# Altium project SAST_PCB_V2_Test_Beta.PrjPcb (part 2 of 2)
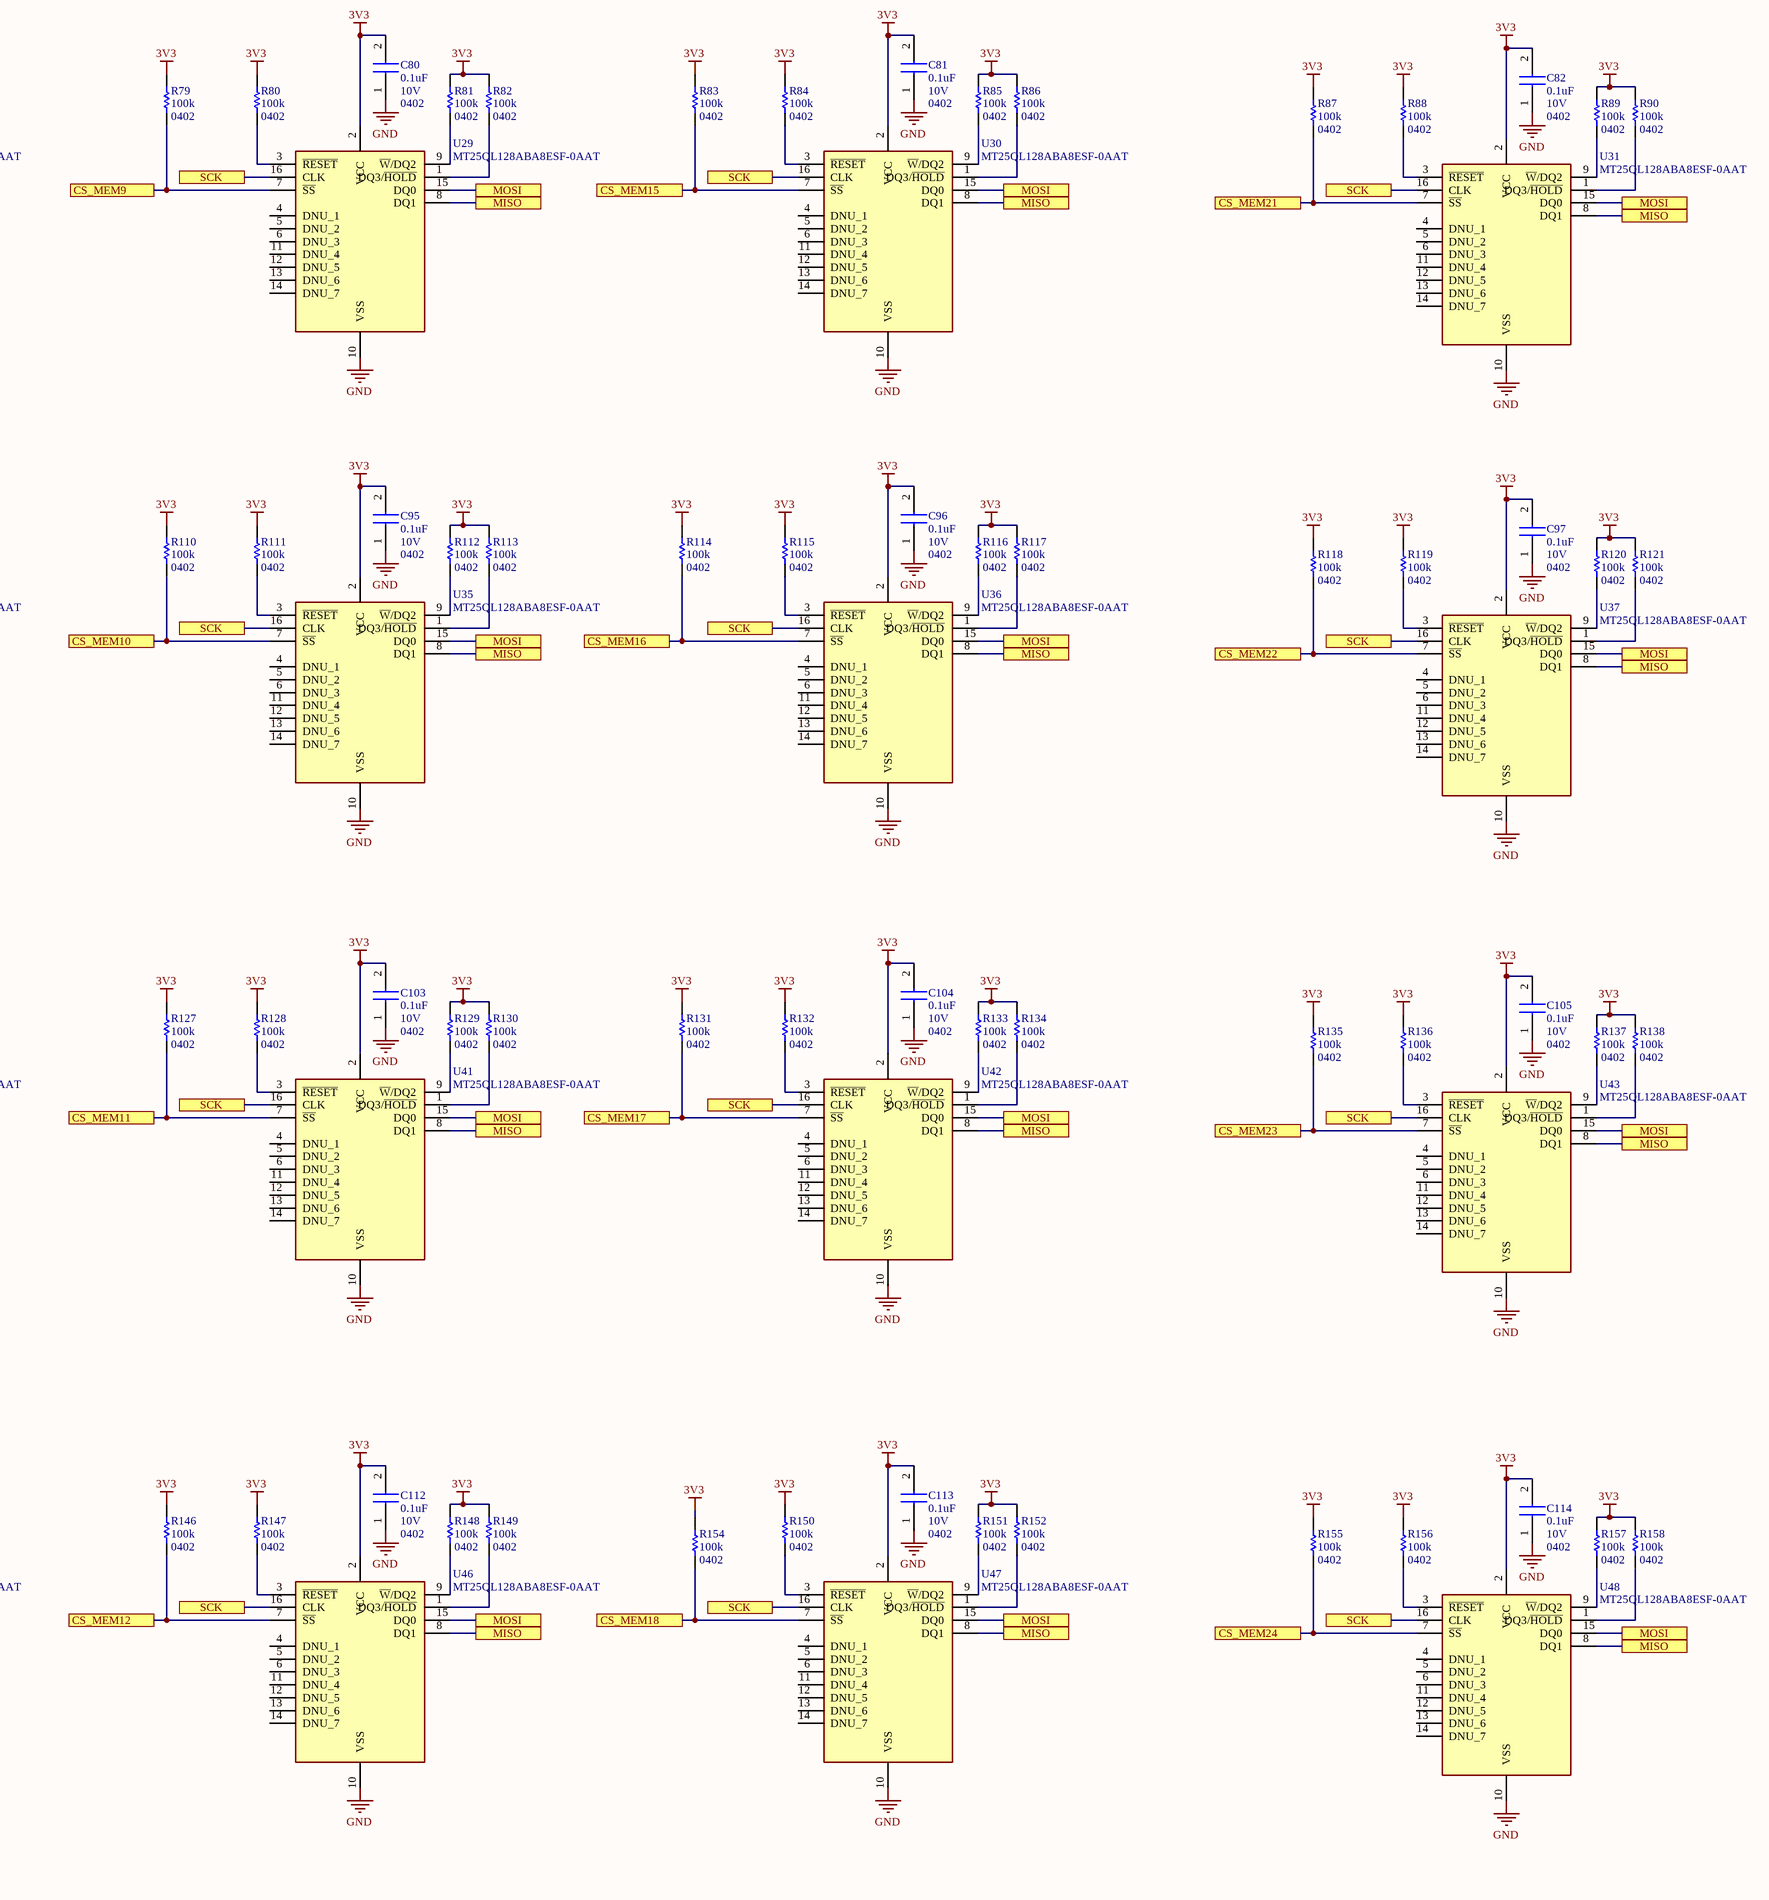
[diagram p6: SAST_PCB_V2B_Test_Beta_Main.SchDoc, bottom right]

## Sheet SAST_PCB_V2B_Test_Beta_Main.SchDoc (continued)

### Nets
3V3: C3.2 C14.1 C27.2 C28.2 C29.2 C30.1 C31.2 C32.1 C54.2 C55.1 C56.2 C57.2 C58.2 C60.2 C61.2 C68.2 C70.2 C71.2 C73.2 C75.2 C79.2 C80.2 C81.2 C82.2 C84.2 C85.2 C86.2 C87.2 C88.2 C89.2 C94.2 C95.2 C96.2 C97.2 C99.2 C100.2 C101.2 C102.2 C103.2 C104.2 C105.2 C106.2 C107.2 C108.2 C109.2 C110.2 C111.2 C112.2 C113.2 C114.2 C115.2 J3.2 J4.1 J19.1 J56.1 L2.2 Q10.4(S2) Q11.4(S2) R13.1 R19.2 R20.2 R22.2 R23.2 R24.2 R25.2 R26.2 R27.2 R28.2 R29.2 R30.2 R31.2 R32.2 R33.2 R34.2 R35.2 R36.2 R37.2 R40.1 R46.1 R47.2 R48.2 R49.2 R50.2 R55.2 R56.2 R57.2 R58.2 R59.2 R60.2 R61.2 R62.2 R63.2 R64.2 R65.2 R66.2 R75.2 R76.2 R77.2 R78.2 R79.2 R80.2 R81.2 R82.2 R83.2 R84.2 R85.2 R86.2 R87.2 R88.2 R89.2 R90.2 R100.2 R106.2 R107.2 R108.2 R109.2 R110.2 R111.2 R112.2 R113.2 R114.2 R115.2 R116.2 R117.2 R118.2 R119.2 R120.2 R121.2 R122.2 R123.2 R124.2 R125.2 R126.2 R127.2 R128.2 R129.2 R130.2 R131.2 R132.2 R133.2 R134.2 R135.2 R136.2 R137.2 R138.2 R139.2 R143.2 R144.2 R145.2 R146.2 R147.2 R148.2 R149.2 R150.2 R151.2 R152.2 R153.2 R154.2 R155.2 R156.2 R157.2 R158.2 R161.2 R174.1 R182.1 R188.1 TP19.1 U2.3(VCCA) U4.5(VIO) U13.1(VS) U13.2(VIO) U14.2(VIO) U14.3(VDD) U15.2(VCC) U16.8(VDD) U17.2(VCC) U18.2(VCC) U19.2(VCC) U21.2(VCC) U22.2(VCC) U23.2(VCC) U25.2(VCC) U26.8(VDD) U28.2(VCC) U29.2(VCC) U30.2(VCC) U31.2(VCC) U32.2(VIN) U33.5(VDD) U33.6(VDD) U33.19(VDRIVE) U34.2(VCC) U35.2(VCC) U36.2(VCC) U37.2(VCC) U38.13(VDD_1) U38.14(VDD_2) U39.7(~{HOLD}/SIO3) U39.8(VCC) U40.2(VCC) U41.2(VCC) U42.2(VCC) U43.2(VCC) U44.13(AVDD) U44.18(VDD_1) U44.32(VDD_2) U44.43(VDD_3) U45.2(VCC) U46.2(VCC) U47.2(VCC) U48.2(VCC) U50.8(VDD) Y1.4(VDD) ; port 3V3
5V: C4.2 C25.2 C26.2 L1.1 Q7.4(S2) R1.2 R6.2 R8.1 R12.1 R21.2 R42.2 R91.2 R172.1 TP18.1 U2.7(VCCB(HV))
GND: C1.1 C2.2 C3.1 C4.1 C5.1 C6.2 C7.1 C8.2 C9.2 C10.2 C11.1 C12.1 C13.1 C14.2 C15.2 C16.1 C17.2 C18.1 C19.2 C20.2 C21.2 C22.2 C23.1 C24.2 C25.1 C28.1 C29.1 C30.2 C33.1 C34.1 C35.2 C36.1 C37.1 C38.1 C39.2 C40.2 C41.1 C42.1 C43.2 C44.1 C45.2 C46.1 C47.2 C48.1 C49.2 C50.1 C52.1 C53.2 C54.1 C55.2 C56.1 C57.1 C58.1 C60.1 C61.1 C62.1 C65.1 C67.1 C68.1 C69.2 C70.1 C71.1 C73.1 C75.1 C77.1 C79.1 C80.1 C81.1 C82.1 C83.1 C84.1 C85.1 C86.1 C87.1 C88.1 C89.1 C93.1 C94.1 C95.1 C96.1 C97.1 C99.1 C100.1 C101.1 C102.1 C103.1 C104.1 C105.1 C106.1 C107.1 C108.1 C109.1 C110.1 C111.1 C112.1 C113.1 C114.1 C115.1 C116.1 C117.1 D2.3(CC) J1.11 J1.12 J1.13 J1.14 J1.15 J3.3 J52.1 J53.1 J57.1 Q2.2(E) Q4.2(E) Q7.1(R2) Q8.2(E) Q9.2(E) Q10.1(R2) Q11.1(R2) R9.2 R11.2 R14.1 R15.1 R18.2 R41.1 R45.1 R70.1 R74.1 R95.1 R97.2 R98.1 R99.1 R102.2 R142.2 R164.1 R183.1 U1.3(GND) U2.2(GND) U3.3(GND) U4.2(VSS) U5.2(GND) U5.3(CTL) U6.4(MODE/SYNC) U6.5(PHASE) U6.7(ILIM) U6.17(GND) U7.3(GND) U8.2(GND) U8.3(CTL) U9.4(GND) U10.5(-VS) U11.2(GND) U11.3(CTL) U12.2(GND) U12.3(CTL) U13.10(GND) U14.4(GND) U15.10(VSS) U16.4(VSS) U17.10(VSS) U18.10(VSS) U19.10(VSS) U20.2(VSS) U21.10(VSS) U22.10(VSS) U23.10(VSS) U24.3(GND) U25.10(VSS) U26.4(VSS) U27.3(GND) U28.10(VSS) U29.10(VSS) U30.10(VSS) U31.10(VSS) U32.4(GND) U33.4(AGND_1) U33.8(AGND_2) U33.17(AGND_3) U33.20(AGND_4) U34.10(VSS) U35.10(VSS) U36.10(VSS) U37.10(VSS) U38.21(~{WR}) U38.23(GND) U38.24(VSS) U38.43(D) U38.49(EP) U39.4(VSS) U40.10(VSS) U41.10(VSS) U42.10(VSS) U43.10(VSS) U44.14(AVSS) U44.19(VSS_1) U44.31(VSS_2) U44.42(VSS_3) U45.10(VSS) U46.10(VSS) U47.10(VSS) U48.10(VSS) U50.4(VSS) Y1.2(GND) ; port GND
3V3_MAG_1: C46.2 C47.1 C49.1 C141.1 Q11.2(D2_1) Q11.3(D2_2) R96.1 R183.2 U9.8(VDD) U10.8(+VS) U20.5(VDD) ; port 3V3_MAG_1
3V3_SWH: C129.1 Q10.2(D2_1) Q10.3(D2_2) R99.2 TP9.1 U2.6(OE) ; port 3V3_SWH
3V3_SWL: Q9.3(C) R100.1 TP10.1 U38.22(~{EN}) ; port 3V3_SWL
5V_IN: F5.2 J1.7 ; port 5V_IN
5V_IN_FUSED: C52.2 C53.1 F5.1 Q6.3(DRAIN) R39.2 U12.1(VIN) ; port 5V_IN_FUSED
5V_SW: C9.1 C10.1 C128.1 J5.1 J58.1 Q7.2(D2_1) Q7.3(D2_2) R4.2 R5.1 R98.2 TP8.1 U1.1(~{OE}) U4.3(VDD) ; port 5V_SW
ADC_REF_2500: C50.2 TP1.1 U32.6(VOUT) U33.7(REFIN) ; port ADC_REF_2500
BAT1: F2.2 J1.1 J1.2 ; port BAT1
BAT2: F3.2 J1.3 J1.4 ; port BAT2
BAT3: F4.2 J1.5 J1.6 ; port BAT3
CAN_Enable: R7.2 U44.6(ANN4/CMP5B/RP77/RD13) ; port CAN_Enable
CAN_IN_FUSED: C5.2 C7.2 C8.1 C11.2 D1.3(A2) D1.4(A1) R2.1 R44.2 ; port CAN_IN_FUSED
CAN_PWR: F1.2 J6.1 ; port CAN_PWR
CAN_RXD: U4.1(TXD) U44.2(RP47/PWM1L/RB15) ; port CAN_RXD
CAN_TXD: U4.4(RXD) U44.1(RP46/PWM1H/RB14) ; port CAN_TXD
CANH: C6.1 D2.1(K1) J8.1 R3.2 U4.7(CANH) ; port CANH
CANL: C15.1 D2.2(K2) J7.1 R3.1 U4.6(CANL) ; port CANL
COM_OVERRIDE: Q4.3(C) R8.2 TP2.1 U24.1(IN) U27.1(~{OE}) ; port COM_OVERRIDE
COM_SW: R10.2 U44.7(AN12/ANN0/RP48/RC0) ; port COM_SW
CS_4K_Gyro: J25.1 U44.48(RP45/PWM2L/RB13) ; port CS_4K_Gyro
CS_CONT: U38.20(~{CS}) U44.40(RP58/PWM7H/RC10) ; port CS_CONT
CS_GYRO: J12.1 U44.38(RP52/PWM5H/ASDA2/RC4) ; port CS_GYRO
CS_HG1: R19.1 U13.6(CS) U44.39(RP53/PWM5L/ASCL2/RC5) ; port CS_HG1
CS_LG1: J18.1 U44.24(DACOUT2/AN16/CMP4C/ISRC2/_RP55/RC7) ; port CS_LG1
CS_LG2: J17.1 U44.17(AN17/ANN1/CMP4B/IBIAS1/_RP54/RC6) ; port CS_LG2
CS_MAG: R40.2 U14.1(CS) U44.16(OA3IN+/AN14/CMP2B/ISRC1/_RP50/RC2) ; port CS_MAG
CS_MEM1: R26.1 U17.7(~{SS}) U38.11(S2) ; port CS_MEM1
CS_MEM2: R55.1 U22.7(~{SS}) U38.10(S3) ; port CS_MEM2
CS_MEM3: R75.1 U28.7(~{SS}) U38.9(S4) ; port CS_MEM3
CS_MEM4: R106.1 U34.7(~{SS}) U38.8(S5) ; port CS_MEM4
CS_MEM5: R123.1 U38.7(S6) U40.7(~{SS}) ; port CS_MEM5
CS_MEM6: R153.1 U38.6(S7) U45.7(~{SS}) ; port CS_MEM6
CS_MEM7: R22.1 U15.7(~{SS}) U38.5(S8) ; port CS_MEM7
CS_MEM8: R47.1 U21.7(~{SS}) U38.4(S9) ; port CS_MEM8
CS_MEM9: R79.1 U29.7(~{SS}) U38.3(S10) ; port CS_MEM9
CS_MEM10: R110.1 U35.7(~{SS}) U38.2(S11) ; port CS_MEM10
CS_MEM11: R127.1 U38.1(S12) U41.7(~{SS}) ; port CS_MEM11
CS_MEM12: R146.1 U38.48(S13) U46.7(~{SS}) ; port CS_MEM12
CS_MEM13: R30.1 U18.7(~{SS}) U38.47(S14) ; port CS_MEM13
CS_MEM14: R59.1 U23.7(~{SS}) U38.46(S15) ; port CS_MEM14
CS_MEM15: R83.1 U30.7(~{SS}) U38.45(S16) ; port CS_MEM15
CS_MEM16: R114.1 U36.7(~{SS}) U38.25(S17) ; port CS_MEM16
CS_MEM17: R131.1 U38.26(S18) U42.7(~{SS}) ; port CS_MEM17
CS_MEM18: R154.1 U38.27(S19) U47.7(~{SS}) ; port CS_MEM18
CS_MEM19: R34.1 U19.7(~{SS}) U38.28(S20) ; port CS_MEM19
CS_MEM20: R63.1 U25.7(~{SS}) U38.29(S21) ; port CS_MEM20
CS_MEM21: R87.1 U31.7(~{SS}) U38.30(S22) ; port CS_MEM21
CS_MEM22: R118.1 U37.7(~{SS}) U38.31(S23) ; port CS_MEM22
CS_MEM23: R135.1 U38.32(S24) U43.7(~{SS}) ; port CS_MEM23
CS_MEM24: R155.1 U38.33(S25) U48.7(~{SS}) ; port CS_MEM24
CS_SRAM1: R122.1 U39.1(~{CS}) U44.15(OA3IN-/AN13/CMP1B/ISRC0/_RP49/RC1) ; port CS_SRAM1
CS_VOLT: R54.1 U44.20(AN15/ANN2/CMP2A/IBIAS2/_RP51/RC3) ; port CS_VOLT
CTL_CS_A0: U38.15(A0) U44.12(OA3OUT/AN4/ANB1/ANB2/CMP3B/_IBIAS3/RA4) ; port CTL_CS_A0
CTL_CS_A1: U38.16(A1) U44.11(DACOUT1/AN27/AN3/CMP1C/RA3) ; port CTL_CS_A1
CTL_CS_A2: U38.17(A2) U44.10(OA1IN+/AN9/RA2) ; port CTL_CS_A2
CTL_CS_A3: U38.18(A3) U44.9(OA1IN-/ANA1/RA1) ; port CTL_CS_A3
CTL_CS_A4: U38.19(A4) U44.8(OA1OUT/AN0/CMP1A/IBIAS0/RA0) ; port CTL_CS_A4
Gyro_CONV: J13.1 U44.33(PGD3/RP37/PWM6L/SDA2/RB5) ; port Gyro_CONV
Gyro_Ref_2048: J2.1 R105.2 ; port Gyro_Ref_2048
Gyro_Ref_4096: J11.1 R94.2 ; port Gyro_Ref_4096
Int_4K_Gyro: J27.1 U44.44(RP65/PWM4H/RD1) ; port Int_4K_Gyro
INT_Alert_2: R20.1 U13.5(INT1) U44.25(OA2OUT/AN1/ANA0/CMP1D/RP34/SCL3/INT0/RB2) ; port INT_Alert_2
MAG_ANAL_1: C48.2 R73.1 TP5.1 U33.10(VIN6) ; port MAG_ANAL_1
MAG_ANAL_2: J21.1 U33.9(VIN7) ; port MAG_ANAL_2
MCLR: J3.1 R163.2 U44.5(!MCLR) ; port MCLR
MISO: U15.8(DQ1) U17.8(DQ1) U18.8(DQ1) U19.8(DQ1) U21.8(DQ1) U22.8(DQ1) U23.8(DQ1) U25.8(DQ1) U28.8(DQ1) U29.8(DQ1) U30.8(DQ1) U31.8(DQ1) U34.8(DQ1) U35.8(DQ1) U36.8(DQ1) U37.8(DQ1) U40.8(DQ1) U41.8(DQ1) U42.8(DQ1) U43.8(DQ1) U44.29(RP57/ASCL1/SDI2/RC9) U45.8(DQ1) U46.8(DQ1) U47.8(DQ1) U48.8(DQ1) ; port MISO
MISO1: J14.1 R51.1 U13.7(MISO) U14.8(SDO) U39.2(SO/SIO1) U44.4(RP61/PWM8L/RC13) ; port MISO1
MISO2: J22.1 U44.45(TMS/RP42/PWM3H/RB10) ; port MISO2
MOSI: U15.15(DQ0) U17.15(DQ0) U18.15(DQ0) U19.15(DQ0) U21.15(DQ0) U22.15(DQ0) U23.15(DQ0) U25.15(DQ0) U28.15(DQ0) U29.15(DQ0) U30.15(DQ0) U31.15(DQ0) U34.15(DQ0) U35.15(DQ0) U36.15(DQ0) U37.15(DQ0) U40.15(DQ0) U41.15(DQ0) U42.15(DQ0) U43.15(DQ0) U44.30(RP72/SDO2/PCI19/RD8) U45.15(DQ0) U46.15(DQ0) U47.15(DQ0) U48.15(DQ0) ; port MOSI
MOSI1: J16.1 R52.1 U13.8(MOSI) U14.7(SDA) U39.5(SI/SIO0) U44.3(RP60/PWM8H/RC12) ; port MOSI1
MOSI2: J23.1 U44.46(TCK/RP43/PWM3L/RB11) ; port MOSI2
OSC: R140.1 U44.21(OSCI/CLKI/AN5/RP32/RB0) ; port OSC
PGEC1: J3.5 U44.37(PGC1/AN11/CMP5A/RP41/SDA1/RB9) ; port PGEC1
PGED1: J3.4 U44.36(PGD1/AN10/CMP6A/RP40/SCL1/RB8) ; port PGED1
POWER_SW: D7.2(A) J26.1 R101.2 R175.2 R184.2 U44.23(AN18/ANC2/CMP3C/ISRC3/RP74/_RD10) ; port POWER_SW
QBUS: J1.10 R17.1 ; port QBUS
SCK: U15.16(CLK) U17.16(CLK) U18.16(CLK) U19.16(CLK) U21.16(CLK) U22.16(CLK) U23.16(CLK) U25.16(CLK) U28.16(CLK) U29.16(CLK) U30.16(CLK) U31.16(CLK) U34.16(CLK) U35.16(CLK) U36.16(CLK) U37.16(CLK) U40.16(CLK) U41.16(CLK) U42.16(CLK) U43.16(CLK) U44.28(RP56/ASDA1/SCK2/RC8) U45.16(CLK) U46.16(CLK) U47.16(CLK) U48.16(CLK) ; port SCK
SCK1: J15.1 R53.1 U13.9(SCK) U14.6(SCL) U39.6(SCK) U44.41(RP59/PWM7L/RC11) ; port SCK1
SCK2: J24.1 U44.47(TDI/RP44/PWM2H/RB12) ; port SCK2
UART1_RX_3V3: R189.2 U2.4(A2) ; port UART1_RX_3V3
UART1_RX_5V: U2.1(B2) U27.2(A) ; port UART1_RX_5V
UART1_TX_3V3: R190.2 U2.5(A1) ; port UART1_TX_3V3
UART1_TX_5V: U1.4(Y) U2.8(B1) ; port UART1_TX_5V
UART2_RX_3V3: J10.1 J54.1 U44.34(PGC3/RP38/PWM6H/SCL2/RB6) ; port UART2_RX_3V3
UART2_TX_3V3: J9.1 J55.1 R188.2 U44.35(TDO/AN2/AN26/CMP3A/RP39/_SDA3/RB7) ; port UART2_TX_3V3
UART_DT_RX_5V_EXT: J1.9 U3.4(Y) ; port UART_DT_RX_5V_EXT
UART_DT_TX_5V_EXT: J1.8 U7.2(A) ; port UART_DT_TX_5V_EXT
VBAT1: C16.2 C17.1 F2.1 Q1.3(DRAIN) U5.1(VIN) ; port VBAT1
VBAT2: C23.2 C24.1 F3.1 Q3.3(DRAIN) U8.1(VIN) ; port VBAT2
VBAT3: C34.2 C35.1 F4.1 Q5.3(DRAIN) U11.1(VIN) ; port VBAT3
VOLT_IN_5V: C38.2 C39.1 C40.1 D4.2(A) L5.2 R67.1 R72.2 TP17.1 U6.1(VIN1) U6.14(RUN1) ; port VOLT_IN_5V
VOLT_IN_BAT: C13.2 C20.1 C21.1 D3.2(A) L3.2 R16.1 R69.2 TP16.1 U6.8(VIN2) U6.10(RUN2) ; port VOLT_IN_BAT
XTAL_ENABLE: R141.2 U44.22(OSCO/CLKO/AN6/RP33/RB1) ; port XTAL_ENABLE
NetC1_2: C1.2 C2.1 R1.1 R4.1 U1.5(VCC)
NetC12_2: C12.2 D1.1(K1) L3.1 Q1.2(SOURCE) Q3.2(SOURCE) Q5.2(SOURCE) U5.6(SENSE) U8.6(SENSE) U11.6(SENSE)
NetC18_2: C18.2 C19.1 R6.1 U3.5(VCC)
NetC22_1: C22.1 U6.12(INTVCC)
NetC26_1: C26.1 R12.2 R15.2 U6.13(FB1)
NetC27_1: C27.1 R13.2 R14.2 U6.11(FB2)
NetC31_1: C31.1 C32.2 U13.3(GND)
NetC33_2: C33.2 R17.2 R18.1 U1.2(A) U3.2(A) U24.5(D)
NetC36_2: C36.2 R16.2
NetC37_2: C37.2 D1.2(K2) L5.1 Q6.2(SOURCE) U12.6(SENSE)
NetC41_2: C41.2 R67.2
NetC42_2: C42.2 C43.1 R21.1 U7.5(VCC)
NetC44_2: C44.2 C45.1 R42.1 U24.2(VDD)
NetC62_2: C62.2 R38.1 U33.16(VIN0)
NetC65_2: C65.2 C69.1 R91.1 U27.5(VCC)
NetC67_2: C67.2 R43.1 U33.15(VIN1)
NetC77_2: C77.2 R68.1 U33.14(VIN2)
NetC83_2: C83.2 R71.1 U33.13(VIN3)
NetC93_2: C93.2 R93.1 U33.12(VIN4)
NetC116_2: C116.2 R161.1 R163.1
NetC117_2: C117.2 R103.1 U33.11(VIN5)
NetC128_2: C128.2 Q7.6(R1_C1) R172.2
NetC129_2: C129.2 Q10.6(R1_C1) R174.2
NetC141_2: C141.2 Q11.6(R1_C1) R182.2
NetD3_1: D3.1(K) D4.1(K) U6.2(SVIN)
NetD5_1: D5.1(C) U24.6(S2)
NetD5_2: D5.2(A) U7.4(Y)
NetD6_1: D6.1(C) U24.4(S1)
NetD6_2: D6.2(A) U27.4(Y)
NetD7_1: D7.1(K) R173.2
NetF1_1: F1.1 L4.1
NetL1_2: L1.2 U6.16(SW1)
NetL2_1: L2.1 U6.9(SW2)
NetL4_2: L4.2 R2.2
NetQ1_1: Q1.1(GATE) U5.5(GATE)
NetQ2_1: Q2.1(B) R7.1 R9.1
NetQ2_3: Q2.3(C) R5.2 U4.8(STBY)
NetQ3_1: Q3.1(GATE) U8.5(GATE)
NetQ4_1: Q4.1(B) R10.1 R11.1 TP3.1
NetQ5_1: Q5.1(GATE) U11.5(GATE)
NetQ6_1: Q6.1(GATE) U12.5(GATE)
NetQ7_5: Q7.5(ON/OFF) R173.1
NetQ8_1: Q8.1(B) R141.1 R142.1
NetQ8_3: Q8.3(C) R139.1 Y1.1(!ST)
NetQ9_1: Q9.1(B) R101.1 R102.1
NetQ10_5: Q10.5(ON/OFF) R175.1
NetQ11_5: Q11.5(ON/OFF) R184.1
NetR23_1: R23.1 U15.3(~{RESET})
NetR24_1: R24.1 U15.9(~{W}/DQ2)
NetR25_1: R25.1 U15.1(DQ3/~{HOLD})
NetR27_1: R27.1 U17.3(~{RESET})
NetR28_1: R28.1 U17.9(~{W}/DQ2)
NetR29_1: R29.1 U17.1(DQ3/~{HOLD})
NetR31_1: R31.1 U18.3(~{RESET})
NetR32_1: R32.1 U18.9(~{W}/DQ2)
NetR33_1: R33.1 U18.1(DQ3/~{HOLD})
NetR35_1: R35.1 U19.3(~{RESET})
NetR36_1: R36.1 U19.9(~{W}/DQ2)
NetR37_1: R37.1 U19.1(DQ3/~{HOLD})
NetR38_2: R38.2 U16.1(VOUTA) U16.2(VINA-)
NetR39_1: R39.1 R41.2 U16.3(VINA+)
NetR43_2: R43.2 U16.6(VINB-) U16.7(VOUTB)
NetR44_1: R44.1 R45.2 U16.5(VINB+)
NetR46_2: R46.2 R54.2 U33.3(~{CS})
NetR48_1: R48.1 U21.3(~{RESET})
NetR49_1: R49.1 U21.9(~{W}/DQ2)
NetR50_1: R50.1 U21.1(DQ3/~{HOLD})
NetR51_2: R51.2 U33.18(DOUT)
NetR52_2: R52.2 U33.2(DIN)
NetR53_2: R53.2 U33.1(SCLK)
NetR56_1: R56.1 U22.3(~{RESET})
NetR57_1: R57.1 U22.9(~{W}/DQ2)
NetR58_1: R58.1 U22.1(DQ3/~{HOLD})
NetR60_1: R60.1 U23.3(~{RESET})
NetR61_1: R61.1 U23.9(~{W}/DQ2)
NetR62_1: R62.1 U23.1(DQ3/~{HOLD})
NetR64_1: R64.1 U25.3(~{RESET})
NetR65_1: R65.1 U25.9(~{W}/DQ2)
NetR66_1: R66.1 U25.1(DQ3/~{HOLD})
NetR68_2: R68.2 U26.1(VOUTA) U26.2(VINA-)
NetR69_1: R69.1 R70.2 U26.3(VINA+)
NetR71_2: R71.2 U26.6(VINB-) U26.7(VOUTB)
NetR72_1: R72.1 R74.2 U26.5(VINB+)
NetR73_2: R73.2 U10.7(VOUT)
NetR76_1: R76.1 U28.3(~{RESET})
NetR77_1: R77.1 U28.9(~{W}/DQ2)
NetR78_1: R78.1 U28.1(DQ3/~{HOLD})
NetR80_1: R80.1 U29.3(~{RESET})
NetR81_1: R81.1 U29.9(~{W}/DQ2)
NetR82_1: R82.1 U29.1(DQ3/~{HOLD})
NetR84_1: R84.1 U30.3(~{RESET})
NetR85_1: R85.1 U30.9(~{W}/DQ2)
NetR86_1: R86.1 U30.1(DQ3/~{HOLD})
NetR88_1: R88.1 U31.3(~{RESET})
NetR89_1: R89.1 U31.9(~{W}/DQ2)
NetR90_1: R90.1 U31.1(DQ3/~{HOLD})
NetR92_1: R92.1 U10.3(RG_2)
NetR92_2: R92.2 U10.2(RG_1)
NetR93_2: R93.2 U50.1(VOUTA) U50.2(VINA-)
NetR94_1: R94.1 R95.2 U50.3(VINA+)
NetR96_2: R96.2 R97.1 U20.3(IN+)
NetR103_2: R103.2 U50.6(VINB-) U50.7(VOUTB)
NetR105_1: R105.1 R164.2 U50.5(VINB+)
NetR107_1: R107.1 U34.3(~{RESET})
NetR108_1: R108.1 U34.9(~{W}/DQ2)
NetR109_1: R109.1 U34.1(DQ3/~{HOLD})
NetR111_1: R111.1 U35.3(~{RESET})
NetR112_1: R112.1 U35.9(~{W}/DQ2)
NetR113_1: R113.1 U35.1(DQ3/~{HOLD})
NetR115_1: R115.1 U36.3(~{RESET})
NetR116_1: R116.1 U36.9(~{W}/DQ2)
NetR117_1: R117.1 U36.1(DQ3/~{HOLD})
NetR119_1: R119.1 U37.3(~{RESET})
NetR120_1: R120.1 U37.9(~{W}/DQ2)
NetR121_1: R121.1 U37.1(DQ3/~{HOLD})
NetR124_1: R124.1 U40.3(~{RESET})
NetR125_1: R125.1 U40.9(~{W}/DQ2)
NetR126_1: R126.1 U40.1(DQ3/~{HOLD})
NetR128_1: R128.1 U41.3(~{RESET})
NetR129_1: R129.1 U41.9(~{W}/DQ2)
NetR130_1: R130.1 U41.1(DQ3/~{HOLD})
NetR132_1: R132.1 U42.3(~{RESET})
NetR133_1: R133.1 U42.9(~{W}/DQ2)
NetR134_1: R134.1 U42.1(DQ3/~{HOLD})
NetR136_1: R136.1 U43.3(~{RESET})
NetR137_1: R137.1 U43.9(~{W}/DQ2)
NetR138_1: R138.1 U43.1(DQ3/~{HOLD})
NetR140_2: R140.2 Y1.3(OUT)
NetR143_1: R143.1 U45.3(~{RESET})
NetR144_1: R144.1 U45.9(~{W}/DQ2)
NetR145_1: R145.1 U45.1(DQ3/~{HOLD})
NetR147_1: R147.1 U46.3(~{RESET})
NetR148_1: R148.1 U46.9(~{W}/DQ2)
NetR149_1: R149.1 U46.1(DQ3/~{HOLD})
NetR150_1: R150.1 U47.3(~{RESET})
NetR151_1: R151.1 U47.9(~{W}/DQ2)
NetR152_1: R152.1 U47.1(DQ3/~{HOLD})
NetR156_1: R156.1 U48.3(~{RESET})
NetR157_1: R157.1 U48.9(~{W}/DQ2)
NetR158_1: R158.1 U48.1(DQ3/~{HOLD})
NetR189_1: R189.1 U44.26(PGD2/OA2IN-/AN8/CMP4A/RP35/RB3)
NetR190_1: R190.1 U44.27(PGC2/OA2IN+/RP36/RB4)
NetTP4_1: TP4.1 U9.5(Vout+) U10.4(+IN)
NetTP6_1: TP6.1 U9.1(Vout-) U10.1(-IN)
NetTP7_1: TP7.1 U10.6(REF) U20.1(VOUT) U20.4(IN-)

Not connected (* = marked no-connect by the designer): U3 1(NC); U5 4(STAT); U6 3(PGOOD1) 6(PGOOD2) 15(NC); U7 1(NC); U8 4(STAT); U9 2(NC) 3(NC) 6(NC) 7(NC); U11 4(STAT); U12 4(STAT); U13 4(INT2); U14 5(INT); U15 4(DNU_1) 5(DNU_2) 6(DNU_3) 11(DNU_4) 12(DNU_5) 13(DNU_6) 14(DNU_7); U17 4(DNU_1) 5(DNU_2) 6(DNU_3) 11(DNU_4) 12(DNU_5) 13(DNU_6) 14(DNU_7); U18 4(DNU_1) 5(DNU_2) 6(DNU_3) 11(DNU_4) 12(DNU_5) 13(DNU_6) 14(DNU_7); U19 4(DNU_1) 5(DNU_2) 6(DNU_3) 11(DNU_4) 12(DNU_5) 13(DNU_6) 14(DNU_7); U21 4(DNU_1) 5(DNU_2) 6(DNU_3) 11(DNU_4) 12(DNU_5) 13(DNU_6) 14(DNU_7); U22 4(DNU_1) 5(DNU_2) 6(DNU_3) 11(DNU_4) 12(DNU_5) 13(DNU_6) 14(DNU_7); U23 4(DNU_1) 5(DNU_2) 6(DNU_3) 11(DNU_4) 12(DNU_5) 13(DNU_6) 14(DNU_7); U25 4(DNU_1) 5(DNU_2) 6(DNU_3) 11(DNU_4) 12(DNU_5) 13(DNU_6) 14(DNU_7); U28 4(DNU_1) 5(DNU_2) 6(DNU_3) 11(DNU_4) 12(DNU_5) 13(DNU_6) 14(DNU_7); U29 4(DNU_1) 5(DNU_2) 6(DNU_3) 11(DNU_4) 12(DNU_5) 13(DNU_6) 14(DNU_7); U30 4(DNU_1) 5(DNU_2) 6(DNU_3) 11(DNU_4) 12(DNU_5) 13(DNU_6) 14(DNU_7); U31 4(DNU_1) 5(DNU_2) 6(DNU_3) 11(DNU_4) 12(DNU_5) 13(DNU_6) 14(DNU_7); U32 1(NC_1) 3(NC_2) 5(NC_3) 7(NC_4) 8(NC_5); U34 4(DNU_1) 5(DNU_2) 6(DNU_3) 11(DNU_4) 12(DNU_5) 13(DNU_6) 14(DNU_7); U35 4(DNU_1) 5(DNU_2) 6(DNU_3) 11(DNU_4) 12(DNU_5) 13(DNU_6) 14(DNU_7); U36 4(DNU_1) 5(DNU_2) 6(DNU_3) 11(DNU_4) 12(DNU_5) 13(DNU_6) 14(DNU_7); U37 4(DNU_1) 5(DNU_2) 6(DNU_3) 11(DNU_4) 12(DNU_5) 13(DNU_6) 14(DNU_7); U38 12(S1) 34(S26) 35(S27) 36(S28) 37(S29) 38(S30) 39(S31) 40(S32) 41(NC_1) 42(NC_2) 44(NC_3); U39 3(SIO2); U40 4(DNU_1) 5(DNU_2) 6(DNU_3) 11(DNU_4) 12(DNU_5) 13(DNU_6) 14(DNU_7); U41 4(DNU_1) 5(DNU_2) 6(DNU_3) 11(DNU_4) 12(DNU_5) 13(DNU_6) 14(DNU_7); U42 4(DNU_1) 5(DNU_2) 6(DNU_3) 11(DNU_4) 12(DNU_5) 13(DNU_6) 14(DNU_7); U43 4(DNU_1) 5(DNU_2) 6(DNU_3) 11(DNU_4) 12(DNU_5) 13(DNU_6) 14(DNU_7); U45 4(DNU_1) 5(DNU_2) 6(DNU_3) 11(DNU_4) 12(DNU_5) 13(DNU_6) 14(DNU_7); U46 4(DNU_1) 5(DNU_2) 6(DNU_3) 11(DNU_4) 12(DNU_5) 13(DNU_6) 14(DNU_7); U47 4(DNU_1) 5(DNU_2) 6(DNU_3) 11(DNU_4) 12(DNU_5) 13(DNU_6) 14(DNU_7); U48 4(DNU_1) 5(DNU_2) 6(DNU_3) 11(DNU_4) 12(DNU_5) 13(DNU_6) 14(DNU_7)

### Layout directives
net class Power: 5V, 5V_IN, 5V_IN_FUSED, 5V_SW, BAT1, BAT2, BAT3, CAN_IN_FUSED, CAN_PWR, NetC12_2, NetC37_2, NetF1_1, NetL4_2, VBAT1, VBAT2, VBAT3, VOLT_IN_5V, VOLT_IN_BAT

### Notes on the sheet
- (in symbol AD8226BRMZ-R7) G =1+49.4k/RG
- (in symbol ADG849YKSZ-REEL) IN=0:S1=On:S2=Off; IN=1:S1=Off:S2=On

### Library data of the parts
C1 C3 C4 C16 C18 C23 C29 C31 C34 C42 C44 C46 C47 C49 C50 C54 C56-C58 C60 C61 C65 C68 C70 C71 C73 C75 C79-C82 C85 C87-C89 C94-C97 C99-C116 = GCM033M8ED104KE07J: Capacitor: 0.1 µF ±10% 10V Ceramic Capacitor X8M 0201; Manufacturer_Name: Murata Electronics; Datasheet Link: https://search.murata.co.jp/Ceramy/image/img/A01X/G101/ENG/GCM033M8ED104KE07-01A.pdf; Height: 0.33mm; Manufacturer_Part_Number: GCM033M8ED104KE07J; Mouser Part Number: 81-GCM033M8ED104KE07; Mouser Price/Stock: https://www.mouser.co.uk/ProductDetail/Murata-Electronics/GCM033M8ED104KE07J?qs=xZFQr2mActesc5d29hjXRw%3D%3D
C2 C5 C11 C19 C43 C45 C69 C84 C86 = GCM21BM8EE106KE08L: Capacitor:  10 µF ±10% 16V Ceramic Capacitor X8M 0805 (2012 Metric); Manufacturer_Name: Murata Electronics; Datasheet Link: https://psearch.en.murata.com/capacitor/product/GCM21BM8EE106KE08%23.html; Height: 1.4mm; Manufacturer_Part_Number: GCM21BM8EE106KE08L; Mouser Part Number: 81-GCM21BM8EE106KE8L; Mouser Price/Stock: https://www.mouser.co.uk/ProductDetail/Murata-Electronics/GCM21BM8EE106KE08L?qs=rrS6PyfT74fl6X5LUXfufw%3D%3D; Arrow Part Number: GCM21BM8EE106KE08L; Arrow Price/Stock: https://www.arrow.com/en/products/gcm21bm8ee106ke08l/murata-manufacturing?region=nac
C6 C15 = CMP-06035-044163-1: Ceramic Capacitor for Automotive 100nF ±10% 25VDC X8L 0402 Paper T/R; Parameter 1: *; Case/Package: *
C7 C12 C13 C36-C38 C41 C52 = GCM155L81E104KE02D: Capacitor: 0.1 µF ±10% 25V Ceramic Capacitor X8L 0402 (1005 Metric); Manufacturer_Name: Murata Electronics; Datasheet Link: https://psearch.en.murata.com/capacitor/product/GCM155L81E104KE02%23.html; Height: 0.55mm; Manufacturer_Part_Number: GCM155L81E104KE02D; Mouser Part Number: 81-GCM155L81E104KE2D; Mouser Price/Stock: https://www.mouser.co.uk/ProductDetail/Murata-Electronics/GCM155L81E104KE02D?qs=5aG0NVq1C4wnQoBdKZwwDA%3D%3D; Arrow Part Number: GCM155L81E104KE02D; Arrow Price/Stock: https://www.arrow.com/en/products/gcm155l81e104ke02d/murata-manufacturing
C8 C17 C24 C30 C32 C35 C53 = GCG188L8EE105KA07D: Capacitor: 1 µF ±10% 16V Ceramic Capacitor X8L 0603; Manufacturer_Name: Murata Electronics; Datasheet Link: https://psearch.en.murata.com/capacitor/product/GCG188L8EE105KA07%23.html; Height: 0.9mm; Manufacturer_Part_Number: GCG188L8EE105KA07D; Mouser Part Number: 81-GCG188L8EE105KA7D; Mouser Price/Stock: https://www.mouser.co.uk/ProductDetail/Murata-Electronics/GCG188L8EE105KA07D?qs=rrS6PyfT74dFMfTR80dVTA%3D%3D; Arrow Part Number: GCG188L8EE105KA07D; Arrow Price/Stock: https://www.arrow.com/en/products/gcg188l8ee105ka07d/murata-manufacturing
C9 C55 = CMP-06035-020214-1: AgPd Termination Conductive Glue Mounting Chip Multilayer Ceramic Capacitors for Automotive 1uF with 10% as tolerance, 16V X8L +15/-40%, 0603 Package; Manufacturer_Part_Number: GCG188L8EE105KA07D; Manufacturer_Name: Murata Electronics; Supplier_Name: Mouser; Supplier_Part_Number: 81-GCG188L8EE105KA7D; Voltage: 16V
  C9: Case/Package: *
C10 = CMP-06035-044163-1: Ceramic Capacitor for Automotive 100nF ±10% 25VDC X8L 0402 Paper T/R; Manufacturer_Name: Murata Electronics; Voltage: 25V; Manufacturer_Part_Number: GCM155L81E104KE02D; Supplier_Name: Mouser; Supplier_Part_Number: 81-GCM155L81E104KE2D; Case/Package: *
C14 = CMP-06035-044163-1: Ceramic Capacitor for Automotive 100nF ±10% 25VDC X8L 0402 Paper T/R; Manufacturer_Name: Murata Electronics; Manufacturing: DNP; Voltage: 25V; Manufacturer_Part_Number: GCM155L81E104KE02D; Supplier_Name: Mouser; Supplier_Part_Number: 81-GCM155L81E104KE2D; Case/Package: *
C20 C21 C39 C40 = CGA6P1X8R1E106K250AC: Capacitor: 10 µF ±10% 25V Ceramic Capacitor X8R 1210 (3225 Metric); Manufacturer_Name: TDK; Datasheet Link: https://product.tdk.com/system/files/dam/doc/product/capacitor/ceramic/mlcc/catalog/mlcc_automotive_hightemp_en.pdf; Height: 2.8mm; Manufacturer_Part_Number: CGA6P1X8R1E106K250AC; Mouser Part Number: 810-A6P1X816K25AC; Mouser Price/Stock: https://www.mouser.co.uk/ProductDetail/TDK/CGA6P1X8R1E106K250AC?qs=Ii670aiJhr7IOyttaEcNrg%3D%3D
C22 = CMP-08246-000036-2: Multilayer Ceramic Capacitors 1μF ±10% 16V X8L SMD 0603; Features: High Temperature; Mount: Surface Mount; Case/Package: *; Case Code (Metric): 1608; Packaging: Tape and Reel; Max Operating Temperature: 150°C; Tolerance: 10%; Min Operating Temperature: -55°C
C25 C28 = CGA6P1X8L1C226M250AC: Capacitor: 22 µF ±20% 16V Ceramic Capacitor X8L 1210 (3225 Metric); Manufacturer_Name: TDK; Datasheet Link: https://product.tdk.com/system/files/dam/doc/product/capacitor/ceramic/mlcc/catalog/mlcc_automotive_hightemp_en.pdf; Height: 2.8mm; Manufacturer_Part_Number: CGA6P1X8L1C226M250AC; Mouser Part Number: 810-CGA6P1X8L1C226M; Mouser Price/Stock: https://www.mouser.co.uk/ProductDetail/TDK/CGA6P1X8L1C226M250AC?qs=gZXFycFWdAPKAWKpq1AXQQ%3D%3D; Arrow Part Number: CGA6P1X8L1C226M250AC; Arrow Price/Stock: https://www.arrow.com/en/products/cga6p1x8l1c226m250ac/tdk?region=nac
C26 C27 = VJ0402A220FXAAC: Capacitor: 22 pF ±1% 50V Ceramic Capacitor C0G, NP0 0402 (1005 Metric); Manufacturer_Name: Vishay; Datasheet Link: http://www.vishay.com/docs/45226/vj31xrohsautomlcc.pdf; Height: 0.55mm; Manufacturer_Part_Number: VJ0402A220FXAAC; Mouser Part Number: 77-VJ0402A220FXAAC; Mouser Price/Stock: https://www.mouser.co.uk/ProductDetail/Vishay-Vitramon/VJ0402A220FXAAC?qs=sMtB33eOQTLLwjCvFx72qA%3D%3D
C33 = CMP-2008-01964-1: Manufacturer: Vitramon; Voltage: 50V; Part Number: VJ0402A151JXAAC; Case/Package: *
C48 C62 C67 C77 C83 C93 C117 C128 C129 C141 = GCM155L81H102KA37D: Capacitor: 1000 pF ±10% 50V Ceramic Capacitor X8L 0402 (1005 Metric); Manufacturer_Name: Murata Electronics; Datasheet Link: https://componentsearchengine.com/Datasheets/2/GCM155L81H102KA37D.pdf; Height: 0.55mm; Manufacturer_Part_Number: GCM155L81H102KA37D; Mouser Part Number: 81-GCM155L81H102KA7D; Mouser Price/Stock: https://www.mouser.co.uk/ProductDetail/Murata-Electronics/GCM155L81H102KA37D?qs=ui%252B2d9lVEI6nM018NUOqBg%3D%3D; Arrow Part Number: GCM155L81H102KA37D; Arrow Price/Stock: https://www.arrow.com/en/products/gcm155l81h102ka37d/murata-manufacturing?region=nac
D1 = BAS40-07,215: Schottky Diode; Manufacturer_Name: Nexperia; Datasheet Link: https://assets.nexperia.com/documents/data-sheet/BAS40-07.pdf; Height: 1.1mm; Manufacturer_Part_Number: BAS40-07,215; Mouser Part Number: 771-BAS40-07215; Mouser Price/Stock: https://www.mouser.co.uk/ProductDetail/Nexperia/BAS40-07215?qs=me8TqzrmIYVNJZ2K5Q9jSg%3D%3D; Arrow Part Number: BAS40-07,215; Arrow Price/Stock: https://www.arrow.com/en/products/bas40-07215/nexperia?region=nac
D2 = PESD2CANFD24L-TR: Diode; Manufacturer_Name: Nexperia; Datasheet Link: https://assets.nexperia.com/documents/data-sheet/PESD2CANFD24L-T.pdf; Height: 1.1mm; Manufacturer_Part_Number: PESD2CANFD24L-TR; Mouser Part Number: 771-PESD2CANFD24L-TR; Mouser Price/Stock: https://www.mouser.co.uk/ProductDetail/Nexperia/PESD2CANFD24L-TR?qs=sPbYRqrBIVkutoukYFqL1w%3D%3D; Arrow Part Number: PESD2CANFD24L-TR; Arrow Price/Stock: https://www.arrow.com/en/products/pesd2canfd24l-tr/nexperia?region=nac; Case/Package: *
D3 D4 D7 = RB521CS-30FHT2RA: Diode: Schottky Diode 30 V 100mA Surface Mount VMN2 (SOD-923); Manufacturer_Name: ROHM Semiconductor; Datasheet Link: https://fscdn.rohm.com/en/products/databook/datasheet/discrete/diode/schottky_barrier/rb521cs-30fht2ra-e.pdf; Height: 0.4mm; Manufacturer_Part_Number: RB521CS-30FHT2RA; Mouser Part Number: 755-RB521CS-30FHT2RA; Mouser Price/Stock: https://www.mouser.co.uk/ProductDetail/ROHM-Semiconductor/RB521CS-30FHT2RA?qs=4v%252BiZTmLVHHIvF1CrltT6w%3D%3D; Case/Package: SOD-923
D5 D6 = CMP-15605-000006-1: Rectifier Diode Switching 75V 0.15A 4ns 2-Pin Case 0805(2012Metric) T/R; Peak Non-Repetitive Surge Current: 2A; Element Configuration: Single; Forward Voltage: 1V; Max Operating Temperature: 175°C; Packaging: Tape and Reel; Radiation Hardening: No; Min Operating Temperature: -65°C; Reverse Recovery Time: 4ns; Mount: Surface Mount; RoHS Compliant: Yes; Max Forward Surge Current (Ifsm): 2A; Case/Package: *; Number of Pins: 2; Max Repetitive Reverse Voltage (Vrrm): 75V
F1-F5 = Fuse 2: Fuse; Manufacturer_Name: Bourns Inc.; Manufacturer_Part_Number: SF-0402FP200-2; Publisher: Altium Limited; PackageDescription: Thru-Hole; 2 Leads; Supplier_Name: Digikey; Supplier_Part_Number: SF-0402FP200-2CT-ND; Value: 2A
  F2-F5: Published: 8-Jun-2000; LatestRevisionDate: 17-Jul-2002; LatestRevisionNote: Re-released for DXP Platform.; PackageReference: PIN-W2/E2.8
J1 = MDLM-15PCBRP-F222: Connector; Manufacturer_Name: ITT CANNON; Height: 0.250; Manufacturer_Part_Number: MDLM-15PCBRP-F222
J2 J4-J19 J21-J27 J52-J58 = Socket: LatestRevisionDate: 17-Jul-2002; LatestRevisionNote: Re-released for DXP Platform.; Publisher: Altium Limited
J3 = TSW-105-05-T-S: Connector; Manufacturer_Name: SAMTEC; Manufacturing: DNP; Datasheet Link: http://suddendocs.samtec.com/prints/tsw-xxx-xx-xxx-x-xx-xxx-mkt.pdf; Manufacturer_Part_Number: TSW-105-05-T-S; Mouser Part Number: 200-TSW10505TS; Mouser Price/Stock: https://www.mouser.co.uk/ProductDetail/Samtec/TSW-105-05-T-S?qs=rU5fayqh%252BE1ZC2pcvjQs1w%3D%3D; Arrow Part Number: TSW-105-05-T-S; Arrow Price/Stock: https://www.arrow.com/en/products/tsw-105-05-t-s/samtec
L1 = IHLP1616BZER4R7M5A: Inductor; Manufacturer_Name: Vishay; Height: 2mm; Manufacturer_Part_Number: IHLP1616BZER4R7M5A; Mouser Part Number: 70-IHLP1616BZR4R7M5A; Arrow Part Number: IHLP1616BZER4R7M5A; Parameter 2: *
L2 = IHLP2020BZER3R3M5A: Inductor: 3.3 µH Shielded Molded Inductor 4 A 74.9mOhm Max Nonstandard; Manufacturer_Name: Vishay; Manufacturer_Part_Number: IHLP2020BZER3R3M5A; Mouser Part Number: 70-IHLP2020BZR3R3M5A; Arrow Part Number: IHLP2020BZER3R3M5A
L3-L5 = Inductor: Code_IEC: 1005; Published: 8-Jun-2000; LatestRevisionDate: 29-May-2009; LatestRevisionNote: IPC-7351 Footprint Added.; Publisher: Altium Limited; PackageDescription: Chip Inductor; Code_JEITA: 0402; Value: ?
Q1 Q3 Q5 Q6 = CMP-1693-00002-4: MOSFET P-CH 20V 4.2A SOT23; Turn-On Delay Time: 10.8ns; Turn-Off Delay Time: 79.3ns; Threshold Voltage: -900mV; Rise Time: 13.7ns; Gate to Source Voltage (Vgs): 8V; Rds On Max: 52mR; Element Configuration: Single; Fall Time: 34.7ns; Max Power Dissipation: 1.4W; Drain to Source Resistance: 200mR; Number of Channels: 1; Input Capacitance: 808pF; Lead Free: Lead Free; Number of Pins: 3; Length: 3mm; Continuous Drain Current (ID): 4.2A; Contact Plating: Tin; Mount: Surface Mount; Weight: 0.000282oz; Min Operating Temperature: -55°C; Package Quantity: 3000; Drain to Source Voltage (Vdss): 20V; On-State Resistance: 52MR; Max Operating Temperature: 150°C; Height: 1.1mm; REACH SVHC: No SVHC; Packaging: Tape and Reel; Radiation Hardening: No; Width: 1.4mm
Q2 Q4 Q8 Q9 = CMP-1048-00779-1: General Purpose Transistor, NPN Silicon, 3-Pin SOT-23, Pb-Free, Tape and Reel; Manufacturer: On Semiconductor; fT Min (MHz): 100; IC Continuous (A): 0.1; Mounting Technology: Surface Mount; ComponentLink1Description: Manufacturer URL; ComponentLink2Description: Datasheet; Polarity: NPN; ComponentLink3URL: http://www.onsemi.cn/pub_link/Collateral/318-08.PDF; DatasheetVersion: Rev. 11; ComponentLink3Description: Package Specification; PartNumber: BC846BLT1G; RoHS: TRUE; PackageDescription: 3-Pin Small Outline Transistor, Body 2.92 x 1.3 mm, Pitch 0.95 mm; PackageReference: SOT-23-3-318-08; ComponentLink2URL: http://www.onsemi.cn/pub_link/Collateral/BC846ALT1-D.PDF; PackageVersion: Rev. AP, 11/2009; ComponentLink1URL: http://www.onsemi.com/; Packing: Tape and Reel; Case/Package: *
Q7 Q10 Q11 = SI3865DDV-T1-GE3: Transistor; Manufacturer_Name: Vishay; Datasheet Link: https://componentsearchengine.com/Datasheets/2/SI3865DDV-T1-GE3.pdf; Height: 1.1mm; Manufacturer_Part_Number: SI3865DDV-T1-GE3; Mouser Part Number: 78-SI3865DDV-T1-GE3; Mouser Price/Stock: https://www.mouser.co.uk/ProductDetail/Vishay-Semiconductors/SI3865DDV-T1-GE3?qs=vuqggo%252BeDiBbC6kpjqT%2F2w%3D%3D; Arrow Part Number: SI3865DDV-T1-GE3; Arrow Price/Stock: https://www.arrow.com/en/products/si3865ddv-t1-ge3/vishay; Case/Package: *
R1 R2 R6 R14-R16 R21 R39 R41 R42 R44 R45 R67 R69 R70 R72 R74 R91 R92 R94 R95 R105 R164 = Resistor 0402: Manufacturer_Name: *; Manufacturer_Part_Number: *; Supplier_Name: *; Supplier_Part_Number: *; Voltage: *
R3 R17 = Resistor 0603: Manufacturer_Name: *; Manufacturer_Part_Number: *; Supplier_Name: *; Supplier_Part_Number: *; Case/Package: *
R4 R5 R8 R9 R11 R18 R40 R46 R102 R142 R161 = Resistor 0402: Manufacturer_Name: Vishay / Dale; Manufacturer_Part_Number: CRCW040210K0FKEDC; Supplier_Name: Mouser; Supplier_Part_Number: 71-CRCW040210K0FKEDC; Voltage: *
R7 R10 R101 R141 = Resistor 0402: Manufacturer_Name: Vishay / Dale; Manufacturer_Part_Number: CRCW04023K30FKEDC; Supplier_Name: Mouser; Supplier_Part_Number: 71-CRCW04023K30FKEDC; Voltage: *
R12 R13 = CMP-2002-00392-1: Manufacturer: Vishay Dale; Part Number: CRCW0402619KFKTD; Case/Package: *
R19 R20 R22-R37 R47-R50 R55-R66 R75-R90 R98-R100 R106-R139 R143-R158 R172-R175 R182-R184 R188 = Resistor 0402: Manufacturer_Name: Vishay / Dale; Manufacturer_Part_Number: CRCW0402100KFKEDC; Supplier_Name: Mouser; Supplier_Part_Number: 71-CRCW0402100KFKEDC; Voltage: *
R38 R43 R51-R54 R68 R71 R73 R93 R96 R97 R103 R189 R190 = Resistor 0402: Manufacturer_Name: Vishay / Dale; Supplier_Name: Mouser; Voltage: *
R140 = Resistor 0402: Manufacturer_Name: Vishay / Dale; Manufacturer_Part_Number: CRCW04024R99FKEDC; Supplier_Name: Mouser; Supplier_Part_Number: 71-CRCW04024R99FKEDC; Voltage: *
R163 = Resistor 0402: Manufacturer_Name: Vishay / Dale; Manufacturer_Part_Number: CRCW04021K00FKEDC; Supplier_Name: Mouser; Supplier_Part_Number: 71-CRCW04021K00FKEDC; Voltage: *
TP1-TP10 TP16-TP19 = Test_Point: Mouser_part_number: 534-4952
U1 U27 = SN74LVC1G240DBVR: Integrated Circuit: Buffer, Inverting 1 Element 1 Bit per Element 3-State Output SOT-23-5; Manufacturer_Name: Texas Instruments; Datasheet Link: http://www.ti.com/lit/gpn/sn74lvc1g240; Height: 1.45mm; Manufacturer_Part_Number: SN74LVC1G240DBVR; Mouser Part Number: 595-SN74LVC1G240DBVR; Mouser Price/Stock: https://www.mouser.co.uk/ProductDetail/Texas-Instruments/SN74LVC1G240DBVR?qs=pajgIaoyDUg%2F8oqYHG2n3w%3D%3D; Arrow Part Number: SN74LVC1G240DBVR; Arrow Price/Stock: https://www.arrow.com/en/products/sn74lvc1g240dbvr/texas-instruments?region=nac
U2 = TXS0102QDCURQ1: Integrated Circuit: Voltage Level Translator Bidirectional 1 Circuit 2 Channel 24Mbps 8-VSSOP; Manufacturer_Name: Texas Instruments; Datasheet Link: http://www.ti.com/lit/gpn/txs0102-q1; Height: 0.9mm; Manufacturer_Part_Number: TXS0102QDCURQ1; Mouser Part Number: 595-TXS0102QDCURQ1; Mouser Price/Stock: https://www.mouser.co.uk/ProductDetail/Texas-Instruments/TXS0102QDCURQ1?qs=7z%252BmIopC6%2FLYetcD%252BnistA%3D%3D; Arrow Part Number: TXS0102QDCURQ1; Arrow Price/Stock: https://www.arrow.com/en/products/txs0102qdcurq1/texas-instruments?region=nac
U3 U7 = CMP-12742-000004-1: IC INVERTER SCHMITT 1CH SOT25; Manufacturer: Diodes Inc.; Max Junction Temp: +150°C; Logic Function Desc: Inverting; Number Of Outputs: 1; Nominal Supply Current: 200uA; Max Supply Voltage: 5.5V; Min Supply Voltage: 1.65V; Propagation Delay: 6.5ns; Standoff Height: 0.013mm; Temperature Range High: +150°C; Package: SOT25; Mouser Description: Inverters 1.65 to 5.5V VCC 1G Schmitt-Trigger INV; RoHS: TRUE; Temperature Range Low: -40°C; Temperature: -40°C to +150°C; Lead Free: Yes; ComponentLink2Description: Datasheet; Octopart: https://octopart.com/74lvc1g14w5-7-diodes+inc.-19991867; Category: IC; Number Of Inputs: 1; Footprint Url: https://www.diodes.com/assets/Package-Files/SOT25.pdf; Height: 1.4mm; Device Class L2: Logic ICs; Device Class L1: Integrated Circuits (ICs); Digikey Description: IC INVERTER SCHMITT 1CH SOT25; Number Of Circuits: 1; Manufacturer Part Number: 74LVC1G14W5-7; Device Class L3: Logic Gates; ComponentLink2URL: https://www.diodes.com/assets/Datasheets/74LVC1G14.pdf; Case/Package: *
U4 = MCP2542FD-H_SN: Integrated Circuit; Manufacturer_Name: Microchip; Manufacturer_Part_Number: MCP2542FD-H/SN; Datasheet Link: http://ww1.microchip.com/downloads/en/devicedoc/20005514a.pdf; Height: 1.75mm; Mouser Part Number: 579-MCP2542FD-H/SN; Mouser Price/Stock: https://www.mouser.co.uk/ProductDetail/Microchip-Technology-Atmel/MCP2542FD-H-SN?qs=qdgZG5p0FZ4YwT%252BnBHAU%252BQ%3D%3D; Arrow Part Number: MCP2542FD-H/SN; Arrow Price/Stock: https://www.arrow.com/en/products/mcp2542fd-hsn/microchip-technology?region=nac; Case/Package: *
U5 U8 U11 U12 = CMP-0479-00437-1: Low Loss PowerPath(TM) Controller, 2.5 to 36 V Vin, 6-pin SOT23 (S6-6), -40 to 125 degC, Pb-Free, Tape and Reel; Manufacturer: Linear Technology; Ideal Diode: Single, External, P-Channel; PackageVersion: Jun-10; ComponentLink3Description: Package Specification; ComponentLink1URL: http://www.linear.com/; ComponentLink3URL: http://cds.linear.com/docs/en/packaging/SOT_6_05-08-1636.pdf; PackageDescription: 6-Pin Plastic TSOT-23, Body 2.9 x 1.63 mm, Pitch 0.95 mm; ComponentLink2Description: Datasheet; Mounting Technology: Surface Mount; ComponentLink1Description: Manufacturer URL; ComponentLink2URL: http://cds.linear.com/docs/en/datasheet/4412hvfs.pdf; PartNumber: LTC4412HVIS6#TRPBF; Packing: Tape and Reel; RoHS: TRUE; PackageReference: S6-6; Code_JEDEC: MO-193; Case/Package: *
U6 = LTC3622HMSE-2#PBF: Buck Switching Regulator IC Positive Adjustable 0.6V 2 Output 1A 16-TFSOP (0.118", 3.00mm Width) Exposed Pad; Manufacturer_Name: Analog Devices; Height: 1.1mm; Manufacturer_Part_Number: LTC3622HMSE-2#PBF; Mouser Part Number: 584-LTC3622HMSE-2PBF
U9 = AAH002-02E: Integrated Circuit: Magnetoresistive Sensor Single Axis 8-SOIC; Manufacturer_Part_Name: NVE Corp/Sensor Products; Manufacturer_Part_Number: AAH002-02E; Supplier: Digikey; Supplier_Part_Number: 391-1046-5-ND
U10 = AD8226BRMZ-R7: Integrated Circuit: Instrumentation Amplifier 1 Circuit Rail-to-Rail 8-MSOP; Manufacturer_Name: Analog Devices; Datasheet Link: https://componentsearchengine.com/Datasheets/1/AD8226BRMZ-R7.pdf; Height: 1.1mm; Manufacturer_Part_Number: AD8226BRMZ-R7; Mouser Part Number: 584-AD8226BRMZ-R7; Mouser Price/Stock: https://www.mouser.co.uk/ProductDetail/Analog-Devices/AD8226BRMZ-R7?qs=%2FtpEQrCGXCy0K1MIqqlxxw%3D%3D; Arrow Part Number: AD8226BRMZ-R7; Arrow Price/Stock: https://www.arrow.com/en/products/ad8226brmz-r7/analog-devices?region=nac
U15 U17-U19 U21-U23 U25 U28-U31 U34-U37 U40-U43 U45-U48 = MT25QL128ABA8ESF-0AAT: Integrated Circuit; Manufacturer_Name: Micron; Datasheet Link: https://eu.mouser.com/datasheet/2/671/mict_s_a0008511421_1-2290752.pdf; Height: 2.65mm; Manufacturer_Part_Number: MT25QL128ABA8ESF-0AAT; Mouser Part Number: 340-279635-TRAY; Mouser Price/Stock: https://www.mouser.co.uk/ProductDetail/Micron/MT25QL128ABA8ESF-0AAT?qs=rrS6PyfT74dUCNvHtkLFjA%3D%3D; Arrow Part Number: MT25QL128ABA8ESF-0AAT; Arrow Price/Stock: https://www.arrow.com/en/products/mt25ql128aba8esf-0aat/micron-technology?region=nac
U16 U26 U50 = CMP-0187-00739-2: None; Number of Circuits: 2; Output Current: 15mA; Input Bias Current: 100pA; Amplifier Type: GENERAL PURPOSE; Max Supply Voltage: 6V; Supply Current: 45uA; Input Offset Voltage (Vos): 4.5mV; Voltage Gain: 110dB; Common Mode Rejection Ratio: 56dB; Unity Gain Bandwidth Product: 1MHz; Min Supply Voltage: 1.8V; Power Supply Rejection Ratio (PSRR): 63dB; Slew Rate: 0.5V/µs; Mount: Surface Mount; Max Operating Temperature: 150°C; Radiation Hardening: No; Case/Package: *; Number of Elements: 2; Technology: CMOS; Number of Pins: 8; RoHS Compliant: Yes; Min Operating Temperature: -40°C; Number of Channels: 2; Nominal Supply Current: 45uA; Packaging: Rail/Tube; Gain Bandwidth Product: 1MHz
U20 = MCP6401T-E_OT: Integrated Circuit: General Purpose Amplifier 1 Circuit Rail-to-Rail SOT-23-5; Manufacturer_Name: Microchip; Datasheet Link: https://componentsearchengine.com/Datasheets/2/MCP6401T-E_OT.pdf; Height: 1.45mm; Mouser Part Number: 579-MCP6401T-E/OT; Mouser Price/Stock: https://www.mouser.co.uk/ProductDetail/Microchip-Technology-Atmel/MCP6401T-E-OT?qs=bxUt0k7cytKn2ZddhA6TyA%3D%3D; Arrow Part Number: MCP6401T-E/OT; Arrow Price/Stock: https://www.arrow.com/en/products/mcp6401t-eot/microchip-technology?region=nac
U24 = ADG849YKSZ-REEL: Integrated Circuit: 1 Circuit IC Switch 2:1 600mOhm SC-70-6; Manufacturer_Name: Analog Devices; Datasheet Link: https://www.analog.com/media/en/technical-documentation/data-sheets/ADG849.pdf; Height: 1.1mm; Manufacturer_Part_Number: ADG849YKSZ-REEL; Mouser Part Number: 584-ADG849YKSZ-R; Mouser Price/Stock: https://www.mouser.co.uk/ProductDetail/Analog-Devices/ADG849YKSZ-REEL?qs=BpaRKvA4VqHaROaFQ8A4tA%3D%3D; Arrow Part Number: ADG849YKSZ-REEL; Arrow Price/Stock: https://www.arrow.com/en/products/adg849yksz-reel/analog-devices?region=nac
U32 = ADR291ERZ: Integrated Circuit:Series Voltage Reference IC Fixed 2.5V V ±0.08% 5 mA 8-SOIC; Manufacturer_Name: Analog Devices; Datasheet Link: https://componentsearchengine.com/Datasheets/2/ADR291ERZ.pdf; Height: 1.75mm; Manufacturer_Part_Number: ADR291ERZ; Mouser Part Number: 584-ADR291ERZ; Mouser Price/Stock: https://www.mouser.co.uk/ProductDetail/Analog-Devices/ADR291ERZ?qs=WIvQP4zGanhT9woRDvpG9Q%3D%3D; Arrow Part Number: ADR291ERZ; Arrow Price/Stock: https://www.arrow.com/en/products/adr291erz/analog-devices?region=nac
U33 = AD7928WBRUZ-REEL: Integrated Circuit:12 Bit Analog to Digital Converter 8 Input 1 SAR 20-TSSOP; Manufacturer_Name: Analog Devices; Datasheet Link: https://www.analog.com/media/en/technical-documentation/data-sheets/AD7908_7918_7928.pdf; Height: 1.2mm; Manufacturer_Part_Number: AD7928WBRUZ-REEL; Mouser Part Number: 584-AD7928WBRUZ-R; Mouser Price/Stock: https://www.mouser.co.uk/ProductDetail/Analog-Devices/AD7928WBRUZ-REEL?qs=%2FtpEQrCGXCzaVU5ACsazjQ%3D%3D; Arrow Part Number: AD7928WBRUZ-REEL; Arrow Price/Stock: https://www.arrow.com/en/products/ad7928wbruz-reel/analog-devices?region=nac
U38 = ADG732BCPZ: Integrated Circuit; Manufacturer_Name: Analog Devices; Datasheet Link: https://datasheet.datasheetarchive.com/originals/distributors/Datasheets-4/DSA-69835.pdf; Height: 1mm; Manufacturer_Part_Number: ADG732BCPZ; Mouser Part Number: 584-ADG732BCPZ; Mouser Price/Stock: https://www.mouser.co.uk/ProductDetail/Analog-Devices/ADG732BCPZ?qs=BpaRKvA4VqHiwXPRyuCIMA%3D%3D; Arrow Part Number: ADG732BCPZ; Arrow Price/Stock: https://www.arrow.com/en/products/adg732bcpz/analog-devices?region=nac; Case/Package: *
U39 = CMP-06316-000005-1: IC SRAM 1MBIT SPI/QUAD I/O 8SOIC; Frequency: 16MHz; Memory Size: 1Mb; Memory Type: Volatile; Lead Free: Lead Free; RoHS Compliant: Yes; Series: -; Max Operating Temperature: 125°C; Case/Package: *; Packaging: Rail/Tube; Min Operating Temperature: -40°C; Mount: Surface Mount
U44 = DSPIC33CK512MP605-I_PT: MCU; Manufacturer_Name: Microchip; GateName_1: G$1; SymbolName_1: DSPIC33CK512MP605-I_PT; LibraryName: DSPIC33CK512MP605-I_PT; DeviceSetName: DSPIC33CK512MP605-I_PT; Mouser_Part_Number: 579-D33CK512MP605IPT; Mouser_Price-Stock: https://www.mouser.co.uk/ProductDetail/Microchip-Technology/dsPIC33CK512MP605-I-PT?qs=Rp5uXu7WBW8OMAQObtLMOg%3D%3D; Manufacturer_Part_Number: DSPIC33CK512MP605-I/PT; Height: 1.2mm; Case/Package: *
Y1 = SIT8920BM-11-33S-8.000000G: GateName_1: G$1; Manufacturer_Part_Number: SIT8920BM-11-33S-8.000000G; Case/Package: *